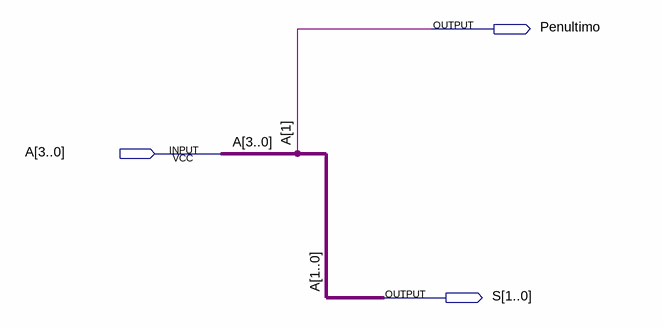
[diagram p0: schematic sheet]
// Quartus schematic TesteFioBUS.bdf as structural Verilog: 0 symbols, 3 pins
module TesteFioBUS (
  input  [3:0] A,
  output Penultimo,
  output [1:0] S
);


  assign Penultimo = A[1];
  assign S = A[1:0];
endmodule
